# EAGLE design main_board (EAGLE 8.2.1)
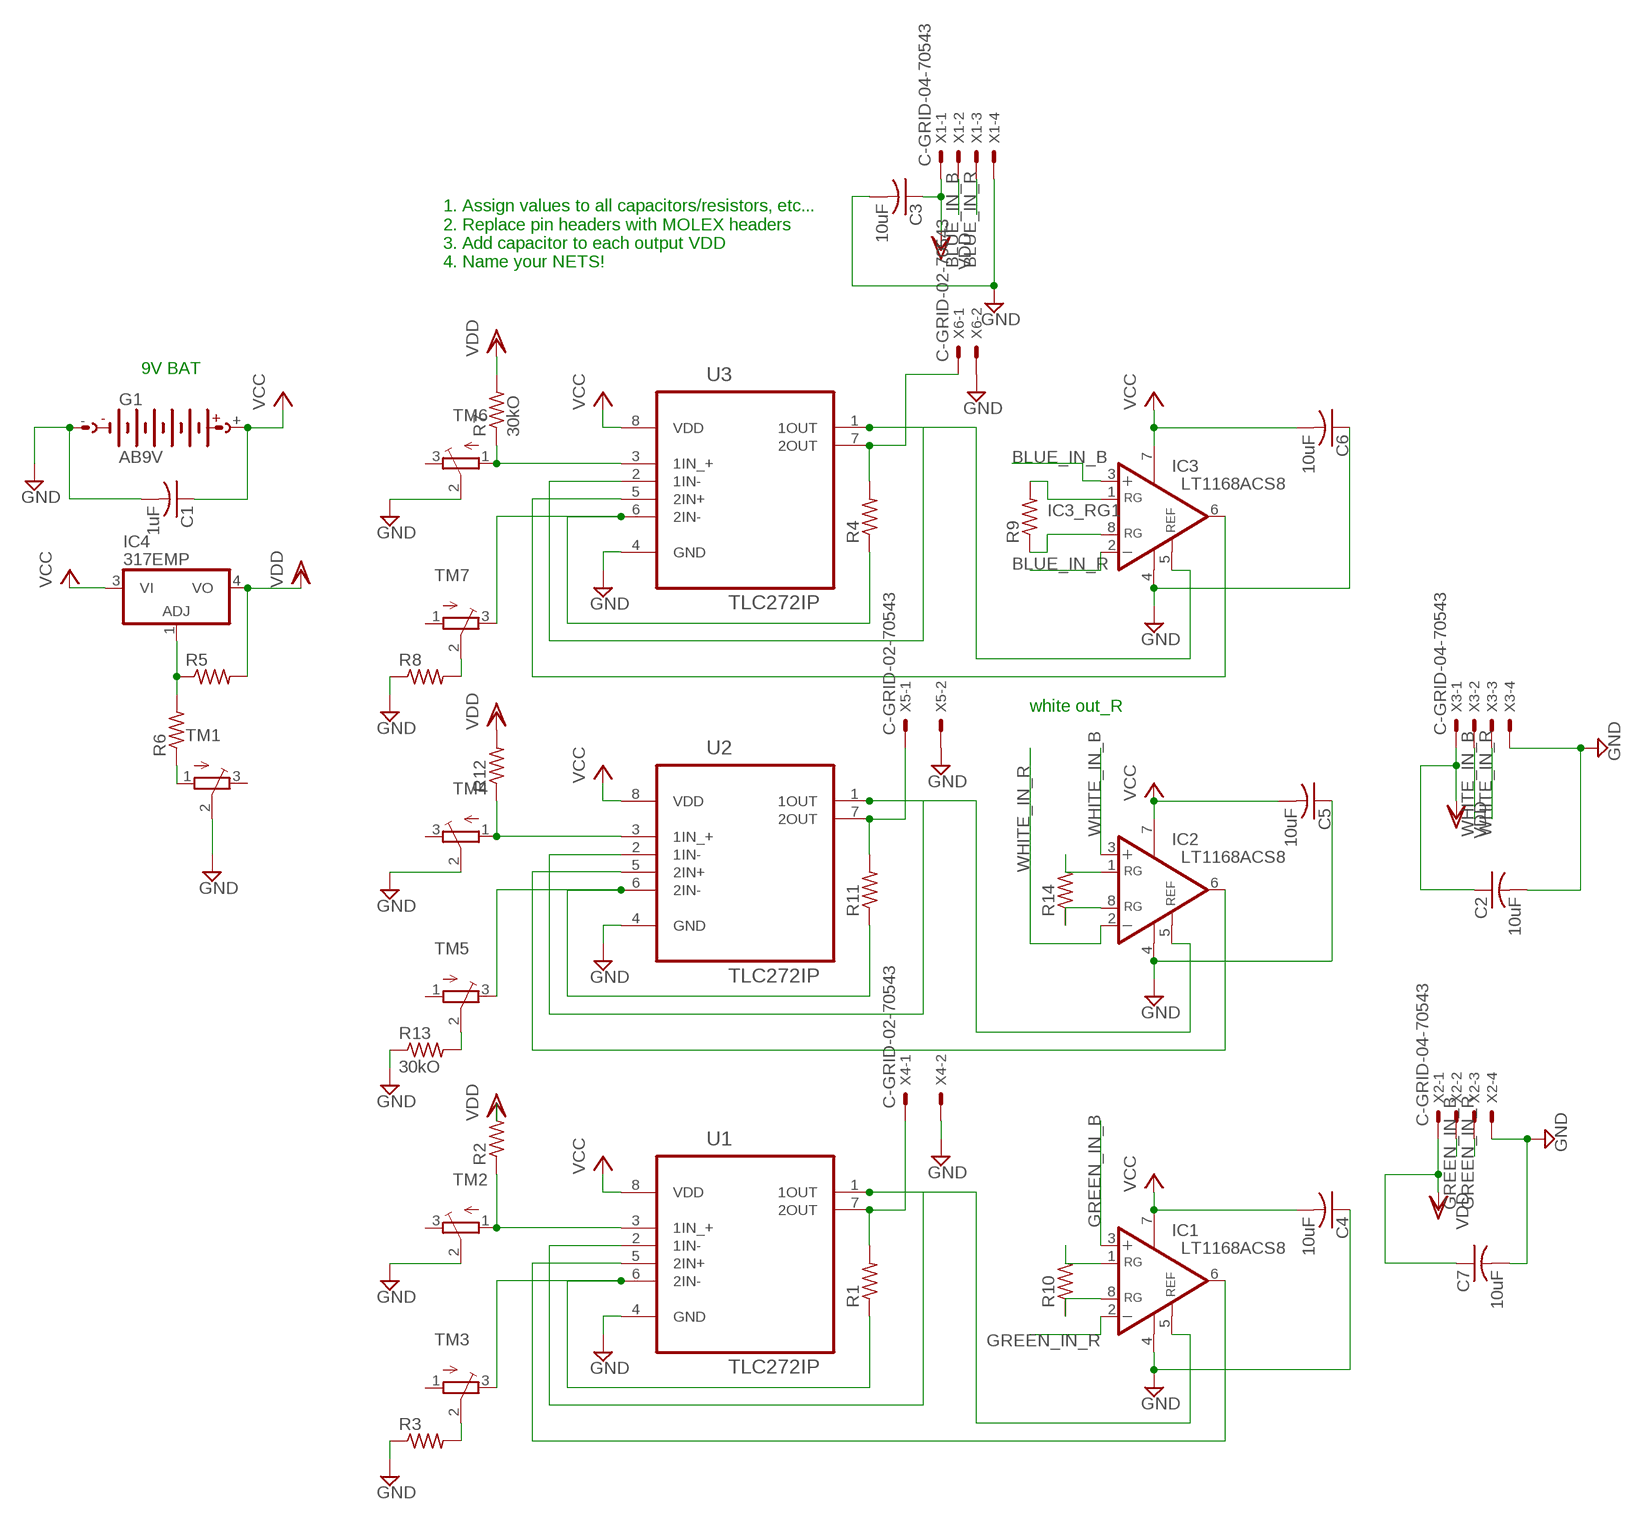
[diagram p0: schematic, sheet 1]

## Parts
C1  1uF  C-USC2012  [C2012]
C2  10uF  C-USC2012  [C2012]
C3  10uF  C-USC2012  [C2012]
C4  10uF  C-USC2012  [C2012]
C5  10uF  C-USC2012  [C2012]
C6  10uF  C-USC2012  [C2012]
C7  10uF  C-USC2012  [C2012]
G1  AB9V  [AB9V]
IC1  LT1168ACS8  [SOIC8]
IC2  LT1168ACS8  [SOIC8]
IC3  LT1168ACS8  [SOIC8]
IC4  317EMP  [SOT223]
R1  R-US_R1206  [R1206]
R2  R-US_R1206  [R1206]
R3  R-US_R1206  [R1206]
R4  R-US_R1206  [R1206]
R5  R-US_R1206  [R1206]
R6  R-US_R1206  [R1206]
R7  30kO  R-US_R1206  [R1206]
R8  R-US_R1206  [R1206]
R9  R-US_R1206  [R1206]
R10  R-US_R1206  [R1206]
R11  R-US_R1206  [R1206]
R12  R-US_R1206  [R1206]
R13  30kO  R-US_R1206  [R1206]
R14  R-US_R1206  [R1206]
TM1  TRIMPOT3386  [TRIM-3386]
TM2  TRIMPOT3386  [TRIM-3386]
TM3  TRIMPOT3386  [TRIM-3386]
TM4  TRIMPOT3386  [TRIM-3386]
TM5  TRIMPOT3386  [TRIM-3386]
TM6  TRIMPOT3386  [TRIM-3386]
TM7  TRIMPOT3386  [TRIM-3386]
U1  TLC272IP  [DIP254P762X508-8]
U2  TLC272IP  [DIP254P762X508-8]
U3  TLC272IP  [DIP254P762X508-8]
X1  C-GRID-04-70543  [70543-04]
X2  C-GRID-04-70543  [70543-04]
X3  C-GRID-04-70543  [70543-04]
X4  C-GRID-02-70543  [70543-02]
X5  C-GRID-02-70543  [70543-02]
X6  C-GRID-02-70543  [70543-02]

## Nets
ADJ: IC4.1(ADJ) R5.1 R6.2
BLUE_IN_B: IC3.3(+IN) X1.2
BLUE_IN_R: IC3.2(-IN) X1.3
GND: C1.2 C2.2 C3.2 C4.1 C5.1 C6.1 C7.2 G1.- IC1.4(V-) IC2.4(V-) IC3.4(V-) R3.1 R8.1 R13.1 TM1.2(S) TM2.2(S) TM4.2(S) TM6.2(S) U1.4(GND) U2.4(GND) U3.4(GND) X1.4 X2.4 X3.4 X4.2 X5.2 X6.2
GREEN_IN_B: IC1.3(+IN) X2.2
GREEN_IN_R: IC1.2(-IN) X2.3
IC3_RG1: IC3.1(RG) R9.2
IC3_RG8: IC3.8(RG) R9.1
N$10: R6.1 TM1.1(A)
N$16: IC1.1(RG) R10.2
N$19: IC1.8(RG) R10.1
N$28: IC2.1(RG) R14.2
N$29: IC2.8(RG) R14.1
TM2POT2: R3.2 TM3.2(S)
TM5POT2: R13.2 TM5.2(S)
TM7POT2: R8.2 TM7.2(S)
U1_1IN+: R2.1 TM2.1(A) U1.3(1IN_+)
U1_1IN-: IC1.5(REF) U1.1(1OUT) U1.2(1IN-)
U1_2IN+: IC1.6(OUT) U1.5(2IN+)
U1_2IN-: R1.1 TM3.3(E) U1.6(2IN-)
U1_2OUT: R1.2 U1.7(2OUT) X4.1
U2_1IN+: R12.1 TM4.1(A) U2.3(1IN_+)
U2_1IN-: IC2.5(REF) U2.1(1OUT) U2.2(1IN-)
U2_2IN+: IC2.6(OUT) U2.5(2IN+)
U2_2IN-: R11.1 TM5.3(E) U2.6(2IN-)
U2_2OUT: R11.2 U2.7(2OUT) X5.1
U3_1_IN+: R7.1 TM6.1(A) U3.3(1IN_+)
U3_1_IN-: IC3.5(REF) U3.1(1OUT) U3.2(1IN-)
U3_2_IN+: IC3.6(OUT) U3.5(2IN+)
U3_2_IN-: R4.1 TM7.3(E) U3.6(2IN-)
U3_2OUT: R4.2 U3.7(2OUT) X6.1
VCC: C1.1 C4.2 C5.2 C6.2 G1.+ IC1.7(V+) IC2.7(V+) IC3.7(V+) IC4.3(VI) U1.8(VDD) U2.8(VDD) U3.8(VDD)
VDD: C2.1 C3.1 C7.1 IC4.4(VO) R2.2 R5.2 R7.2 R12.2 X1.1 X2.1 X3.1
WHITE_IN_B: IC2.3(+IN) X3.2
WHITE_IN_R: IC2.2(-IN) X3.3
Unconnected: TM1.3(E) TM2.3(E) TM3.1(A) TM4.3(E) TM5.1(A) TM6.3(E) TM7.1(A)

## Notes on the sheet
- 1. Assign values to all capacitors/resistors, etc...
  2. Replace pin headers with MOLEX headers
  3. Add capacitor to each output VDD
  4. Name your NETS!
- 9V BAT
- white out_R

## Library data of the parts
C1-C7 = adafruit:C-US: CAPACITOR, American symbol
G1 = battery:AB9V: 9-V BATTERY CLIP
IC1-IC3 = linear-technology:LT1168: Low Power, Single Resistor Gain Programmable, Precision Instrumentation Amplifier SourcE: LT1168.pdf; MPN: LT1168ACS8; OC_FARNELL: unknown; OC_NEWARK: 57M2316
IC4 = linear:*317: Positive VOLTAGE REGULATOR
R1-R14 = adafruit:R-US_: RESISTOR, American symbol
TM1-TM7 = adafruit:TRIMPOT: SMT trimmer potentiometer part number TC33X http://www.ladyada.net/library/eagle
U1-U3 = Texas Instruments_By_element14_Batch_1:TLC272IP: OPERATIONAL AMPLIFIER; MPN: TLC272IP; OC_FARNELL: 2386835; OC_NEWARK: 08F9090; PACKAGE: PDIP; SUPPLIER: Texas Instruments
X1-X3 = con-molex:C-GRID-04: CONNECTOR wire to board 2.54 mm (0.100") pitch header; OC_FARNELL: unknown; OC_NEWARK: unknown
X4-X6 = con-molex:C-GRID-02: CONNECTOR wire to board 2.54 mm (0.100") pitch header; OC_FARNELL: unknown; OC_NEWARK: unknown

## Net classes
0 default: width 0.305 mm, drill 0.432 mm, clearance 0.254 mm

## Board
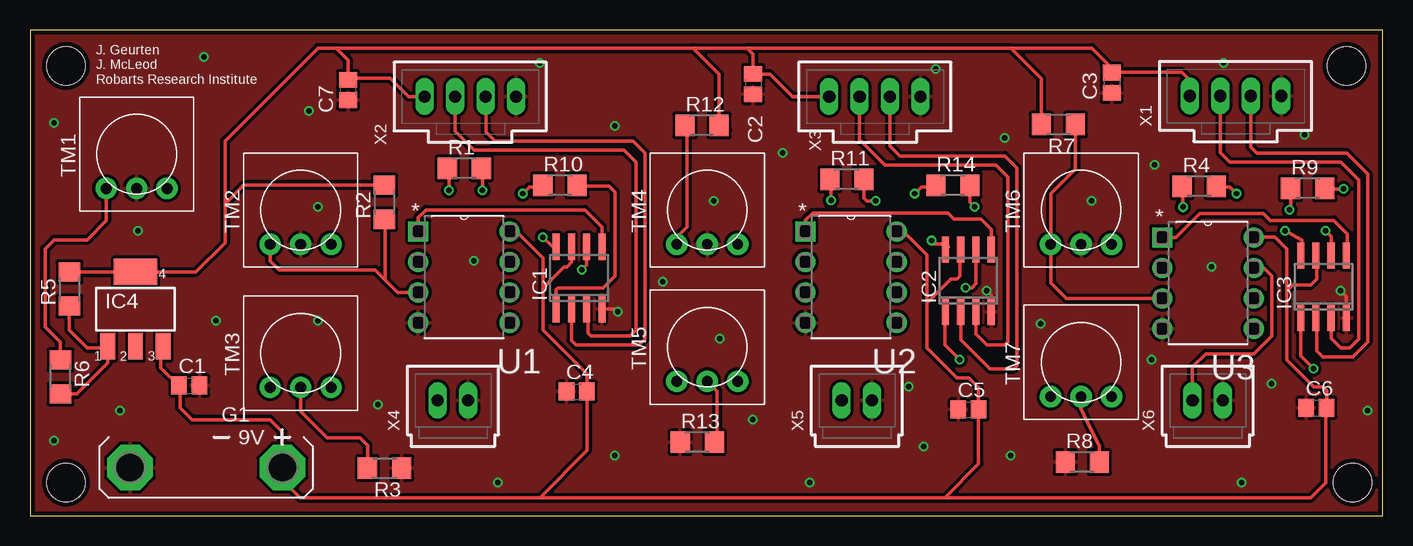
[diagram p1: board, top side]
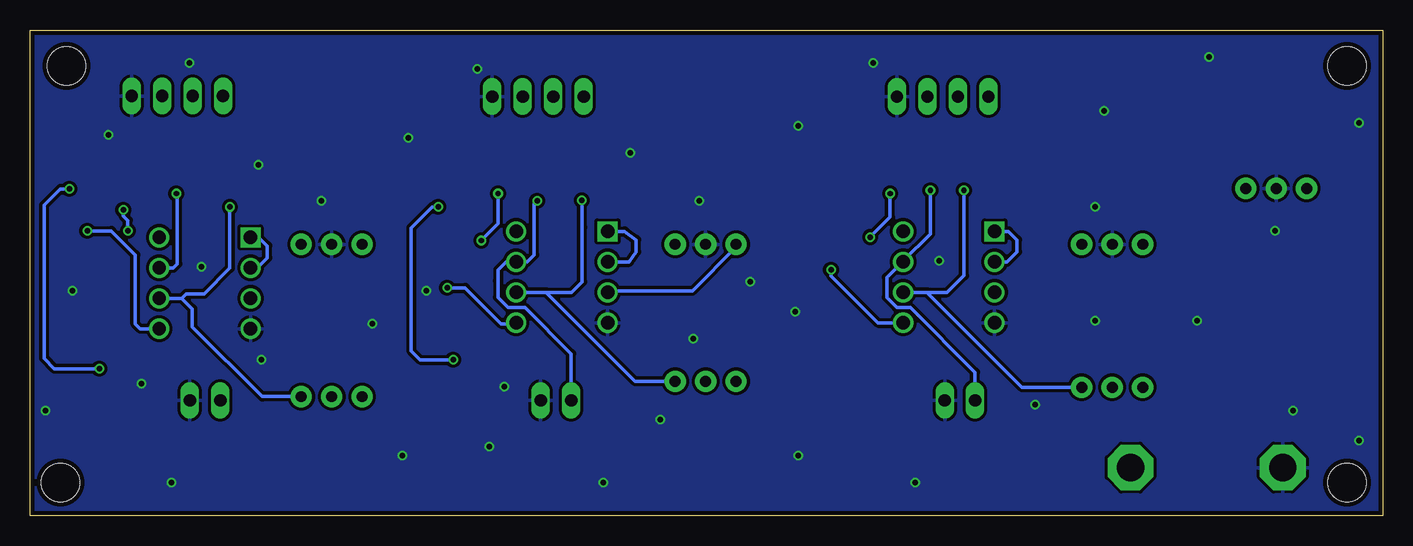
[diagram p2: board, bottom side, seen from below]

Size 112.78 x 40.5 mm. Coordinates in mm from the lower left corner, seen from the top.
Outline: 0,0 112.78,0 112.78,40.5 0,40.5 0,0
Copper layers (1*16): Top 0.0356mm / dielectric 1.5011mm / Bottom 0.0356mm
Design rules "oshpark-2layer": minimum track width 6mil, minimum drill 13mil, track to track 6mil, track to pad 6mil, pad to pad 6mil, via to via 6mil, smd to smd 6mil, copper to edge 15mil, drill to drill 6mil, minimum pad ring 7mil, minimum via ring 7mil, stop-mask expansion 2.5mil, vias tented up to drill 0mil, thermal gap 10mil
Holes 3.2 mm at 3,37.5 3,2.75 110.25,2.75 109.75,37.5

### Footprints (pad centres in the part's own frame; a part is rotated, then mirrored left to right if it is on the bottom)
C2012 = smd 1.3 x 1.5: 1 -0.85,0; 2 0.85,0
AB9V = drill 2.286 pad 3.81 octagon: + 0,2.54; - 0,-10.16
SOIC8 = smd 0.6 x 2.2: 1 -1.905,-2.6; 2 -0.635,-2.6; 3 0.635,-2.6; 4 1.905,-2.6; 5 1.905,2.6; 6 0.635,2.6; 7 -0.635,2.6; 8 -1.905,2.6
SOT223 = smd 1.219 x 2.235: 1 -2.311,-3.099; 2 0,-3.099; 3 2.311,-3.099 | smd 3.6 x 2.2: 4 0,3.099
R1206 = smd 1.6 x 1.803: 1 -1.422,0; 2 1.422,0
TRIM-3386 = drill 0.9 pad 1.778: 1 -2.54,-2.857; 2 0,-2.857; 3 2.54,-2.857
DIP254P762X508-8 = drill 1.118 square: 1 -7.62,7.62 | drill 1.118: 2 -7.62,5.08; 3 -7.62,2.54; 4 -7.62,0; 5 0,0; 6 0,2.54; 7 0,5.08; 8 0,7.62
70543-04 = drill 1.016 long: 1 -3.81,0; 2 -1.27,0; 3 1.27,0; 4 3.81,0
70543-02 = drill 1.016 long: 1 -1.27,0; 2 1.27,0

### Placement (x,y rotation side)
C1  13.28,10.84 0 top
C2  60.29,35.98 270 top
C3  90.18,36.09 270 top
C4  45.58,10.34 0 top
C5  78.23,8.84 0 top
C6  107.24,8.98 0 top
C7  26.5,35.5 270 top
G1  18.5,4 270 top
IC1  45.77,19.81 0 top
IC2  78.22,19.59 0 top
IC3  107.83,19.09 0 top
IC4  8.79,17.22 0 top
R1  10kO  [R1206]  36.21,28.96 0 top
R2  30kO  [R1206]  29.54,26.13 90 top
R3  2kO  [R1206]  29.55,3.96 180 top
R4  10kO  [R1206]  97.47,27.46 0 top
R5  1KO  [R1206]  3.29,18.89 90 top
R6  4kO  [R1206]  2.54,11.56 270 top
R7  85.73,32.61 180 top
R8  2kO  [R1206]  87.73,4.46 0 top
R9  110 ohm  [R1206]  106.51,27.29 0 top
R10  110ohm  [R1206]  44.18,27.54 0 top
R11  10kO\  [R1206]  68.1,28.04 0 top
R12  30kO  [R1206]  56.02,32.54 0 top
R13  2kO  [R1206]  55.63,6.11 0 top
R14  110 ohm  [R1206]  76.94,27.54 0 top
TM1  8.89,30.14 0 top
TM2  22.56,25.48 0 top
TM3  22.56,13.55 0 top
TM4  56.46,25.48 0 top
TM5  56.46,14.05 0 top
TM6  87.63,25.48 0 top
TM7  87.63,12.78 0 top
U1  39.99,16.08 0 top
U2  72.25,16.08 0 top
U3  102.01,15.58 0 top
X1  100.5,35 0 top
X2  36.7,34.95 0 top
X3  70.43,34.95 0 top
X4  35.26,9.6 0 top
X5  68.93,9.6 0 top
X6  98.18,9.6 0 top

### Tracks (layer width: path | path; a pad name or v marks a point on that pad's centre or on a via)
ADJ
  Top 0.305: R6.2 3.89,10.14 6.48,12.73 IC4.1 6.36,14 4.75,14 3.29,15.46 R5.1
BLUE_IN_B
  Top 0.305: IC3.3 108.47,14.79 109.25,14 110,14 110.75,14.75 110.75,28 109.38,29.38 | 109.38,29.38 109.25,29.5 | X1.2 99.23,30.27 100,29.5 109.25,29.5 | 109.25,29.5 109.38,29.38
BLUE_IN_R
  Top 0.305: IC3.2 107.25,16.43 107.25,13.75 107.75,13.25 110.25,13.25 111.5,14.5 111.5,28.5 109.75,30.25 102.25,30.25 101.77,30.73 X1.3
GND  (via drill 0.45)
  Top 0.305: IC1.4 48.79,17.21 v49,17 | IC2.4 80.12,18.38 v79.75,18.75 | IC3.4 109.73,18.27 v109.25,18.75
  other vias: 23.25,33.75 62.75,30.25 29,9.25 15.5,16.25 9,23.75 60.25,8 73.25,10.75 93.5,13 93.75,29.25 106.25,31.75 81.25,31.5 103.5,11 48.75,32.5 14.5,38.25 39,2.75 65,2.75 101,2.75 111.5,8.75 2,6.25 37,21.25 24,25.75 24,16.25 57.5,14.75 57,26.25 75.5,37.25 42.5,37.75 99.5,37.75 98.5,20.75 88.5,26.25 48.75,5 84.25,16 81.75,5 52.75,19.5 2,32.75 74.5,5.75 7.5,8.75
  pour Top: -2,43.5 -2,-2 113,-2 116.5,1.5 116.5,43.5 115.5,44.5
  pour Bottom: -3.5,45.25 -3.5,-3 114,-3 118.25,1.25 118.25,44.75 116.5,46.5 -2.25,46.5
GREEN_IN_B
  Top 0.305: IC1.3 46.38,17.07 46.5,16.95 46.5,15.25 46.75,15 50,15 50.5,15.5 50.5,29.5 49.5,30.5 37,30.5 35.43,32.07 X2.2
GREEN_IN_R
  Top 0.305: IC1.2 45.13,14.61 45.5,14.25 50.75,14.25 51.25,14.75 51.25,30.25 50.25,31.25 38.75,31.25 38,32 38,35.17 X2.3
IC3_RG1  (via drill 0.45)
  Top 0.305: v107,12.25 105.92,13.32 IC3.1 | v109.5,27.25 107.97,27.25 R9.2
  Bottom 0.305: v107,12.25 110.75,12.25 111.61,13.11 111.61,25.89 110.25,27.25 v109.5,27.25
IC3_RG8  (via drill 0.45)
  Top 0.305: R9.1 105.09,25.59 v105,25.5 | v104.62,23.75 106,23 106,21.77 IC3.8
  Bottom 0.305: v105,25.5 105,25 104.62,24.62 v104.62,23.75
N$10
  Top 0.305: R6.1 2.54,14.46 1.25,15.75 1.25,22.25 2,23 4.75,23 6.35,24.6 TM1.1
N$16
  Top 0.305: IC1.1 43.87,18.86 44,19 47.75,19 48.75,20 48.75,27 48.25,27.5 45.64,27.5 R10.2
N$19  (via drill 0.45)
  Top 0.305: v41.07,26.85 41.63,27.41 42.75,27.41 R10.1 | v42.75,23.22 43.59,22.38 IC1.8
  Bottom 0.305: v41.07,26.85 41.07,24.9 v42.75,23.22
N$28  (via drill 0.45)
  Top 0.305: R14.2 78.36,26.14 v78.75,25.75 | v77.5,13 76.25,14.25 76.25,16.93 IC2.1
  Bottom 0.305: v78.75,25.75 79.25,25.75 81,24 81,13.75 80.25,13 v77.5,13
N$29  (via drill 0.45)
  Top 0.305: v73.76,26.85 74.32,27.41 75.44,27.41 R14.1 | v75.16,22.94 75.44,22.66 76.28,22.66 76.56,22.38 IC2.8
  Bottom 0.305: v73.76,26.85 73.76,24.34 v75.16,22.94
TM2POT2
  Top 0.305: TM3.2 22.56,8.69 24.75,6.5 27.5,6.5 28.13,5.87 R3.2
TM5POT2
  Top 0.305: R13.2 57.28,6.18 57.28,10.37 57,10.65 56.72,10.65 56.44,10.93 TM5.2
TM7POT2
  Top 0.305: R8.2 89.13,4.5 89.13,5.82 88.11,7.87 87.61,8.92 TM7.2
U1_1IN+
  Top 0.305: R2.1 29.62,24.62 29.62,19.63 | U1.3 30.63,18.62 29.62,19.63 | TM2.1 20.02,21.23 20.75,20.5 28.75,20.5 29.62,19.63
U1_1IN-
  Top 0.305: IC1.5 47.67,24.07 46.25,25.5 33,25.5 32.37,24.87 U1.1
  Bottom 0.305: U1.1 31.2,23.7 30.5,23 30.5,22 31.34,21.16 U1.2
U1_2IN+  (via drill 0.45)
  Top 0.305: IC1.6 46.41,20.91 v46,20.5
  Bottom 0.305: U1.5 42.08,16.08 46,20 v46,20.5
U1_2IN-  (via drill 0.45)
  Top 0.305: v34.92,27.13 34.92,28.81 R1.1
  Bottom 0.305: 38,18.62 U1.6 | 38,18.62 36.32,18.62 34.92,20.02 v34.92,27.13 | 38,18.62 30.07,10.69 TM3.3
U1_2OUT  (via drill 0.45)
  Top 0.305: v37.72,27.13 37.72,28.81 R1.2
  Bottom 0.305: v37.72,27.13 37.72,23.5 39.95,21.26 U1.7 40.23,20.98 41.35,19.87 41.35,18.19 40.51,17.35 39.4,17.35 33.99,11.95 X4.1
U2_1IN+
  Top 0.305: R12.1 54.76,32.44 54.76,24.06 53.92,23.22 53.92,22.66 TM4.1
  Bottom 0.305: U2.3 64.54,18.75 57.56,18.75 53.92,22.38 TM4.1
U2_1IN-
  Top 0.305: 80.19,22.38 IC2.5 80.12,23.88 79.25,24.75 77,24.75 76.5,25.25 65.25,25.25 64.63,24.63 U2.1
  Bottom 0.305: U2.1 63.2,23.7 62.25,23 62.25,22 62.84,21.16 U2.2
U2_2IN+  (via drill 0.45)
  Top 0.305: IC2.6 78.86,19.36 78.5,19 v78,19
  Bottom 0.305: v78,19 76.5,19 73.5,16 72.33,16 U2.5
U2_2IN-  (via drill 0.45)
  Top 0.305: v66.78,26.29 66.78,27.97 R11.1
  Bottom 0.305: v66.78,26.29 66.78,24.06 66.75,24.03 66.75,19.5 67.63,18.62 69.75,18.62 | 69.75,18.62 U2.6 | TM5.3 62.32,11.19 69.75,18.62
U2_2OUT  (via drill 0.45)
  Top 0.305: v70.5,26.25 69.75,26.25 69.5,26.5 69.5,28.02 R11.2
  Bottom 0.305: v70.5,26.25 70.75,26 70.75,21.75 71.34,21.16 U2.7 73.09,21.16 73.75,20.5 73.75,19.6 73.76,19.59 73.76,18.19 72.92,17.35 71.53,17.35 67.66,13.49 X5.1
U3_1_IN+
  Top 0.305: R7.1 87.15,28.9 85.09,26.84 TM6.1 85.09,19.41 86.38,18.12 U3.3
U3_1_IN-
  Top 0.305: IC3.5 109.8,21.82 109.8,23.5 108.69,24.62 103.38,24.62 102.82,25.18 97.51,25.18 95.53,23.2 U3.1
  Bottom 0.305: U3.1 93.7,23.2 93,22.5 93,21.5 93.84,20.66 U3.2
U3_2_IN+  (via drill 0.45)
  Top 0.305: IC3.6 108.47,23.29 v108,23.75
  Bottom 0.305: v108,23.75 106,23.75 104,21.75 104,16 103.58,15.58 U3.5
U3_2_IN-  (via drill 0.45)
  Top 0.305: v96.11,25.73 96.11,27.41 R4.1
  Bottom 0.305: v96.11,25.73 96.11,20.64 98.25,18.5 99.74,18.5 100.12,18.12 | TM7.3 93.42,9.92 99.25,15.75 99.25,17.25 100.12,18.12 | 100.12,18.12 U3.6
U3_2OUT  (via drill 0.45)
  Top 0.305: v100.58,26.85 100.03,27.41 98.91,27.41 R4.2 | U3.7 102.84,20.66 103.5,20 103.5,15 102,13.5 98,13.5 96.91,12.41 X6.1
  Bottom 0.305: U3.7 100.84,20.66 100.5,21 100.5,26.77 v100.58,26.85
VCC
  Top 0.305: IC4.3 10.9,14 10.9,12.32 12.38,10.84 C1.1 12.57,10.65 12.5,10.57 12.5,9 13.5,8 20,8 21.04,6.96 G1.+ 21.04,2.96 22.5,1.5 42.5,1.5 | 108.25,9.14 C6.2 | 46.25,10.52 C4.2 | 42.5,1.5 76.25,1.5 | 76.25,1.5 106.75,1.5 108,2.75 108,8.89 C6.2 | C6.2 108.09,10.41 107.75,10.75 107,10.75 104.75,13 104.75,18.75 | 104.75,18.75 105.25,19.25 106.75,19.25 107.25,19.75 107.25,21.64 IC3.7 | U3.8 102.06,23.25 103.75,23.25 104.75,22.25 104.75,18.75 | 76.25,1.5 79.08,4.33 C5.2 79.08,10.67 78.25,11.5 77.25,11.5 74.75,14 74.75,17.75 | 74.75,17.75 76.75,19.75 77.25,19.75 77.5,20 77.5,22.11 IC2.7 | 74.75,17.75 74.75,21.75 72.8,23.7 U2.8 | C4.2 46.43,5.43 42.5,1.5 | C4.2 46.43,11.82 42.75,15.5 42.75,19 | 42.75,19 42.75,21.5 40.55,23.7 U1.8 | IC1.7 45.13,21.14 44.75,20.75 44.5,20.75 42.75,19
  Bottom 0.305: 101.98,23.22 U3.8
VDD
  Top 0.305: 29.62,27.69 R2.2 | 8.94,20.43 IC4.4 | 29.34,27.41 R2.2 | 57.56,32.72 R12.2 | 58.12,32.16 57.84,32.16 57.56,32.44 R12.2 | 55.25,39 59.75,39 | 25.5,39 55.25,39 | 25.5,39 24,39 16.25,31.25 16.25,26 | 81.75,39 88.5,39 90.18,37.32 C3.1 90.24,37 96,37 96.69,36.31 X1.1 | 81.75,39 59.75,39 | 59.75,39 60.29,38.46 C2.1 61.67,36.83 63.55,34.95 X3.1 | R12.2 57.44,36.81 55.25,39 | R7.2 84.31,36.44 81.75,39 | R5.2 IC4.4 | IC4.4 13.82,20.32 16.25,22.75 16.25,26 | R2.2 17.8,27.55 16.25,26 | 25.5,39 26.5,38 C7.1 26.65,36.5 30,36.5 31.55,34.95 X2.1
WHITE_IN_B
  Top 0.305: IC2.3 78.86,15.14 79.75,14.25 81.25,14.25 81.5,14.5 81.5,28.25 80.5,29.25 71.25,29.25 69.16,31.34 X3.2
WHITE_IN_R
  Top 0.305: 77.67,16.79 IC2.2 77.58,14.66 80,12.25 82,12.25 82.25,12.5 82.25,29 81.25,30 72.5,30 71.7,30.8 X3.3

### Text on the board
tNames: J. Geurten / J. McLeod / Robarts Research Institute